# EAGLE design m-power-v0 (EAGLE 5.07)
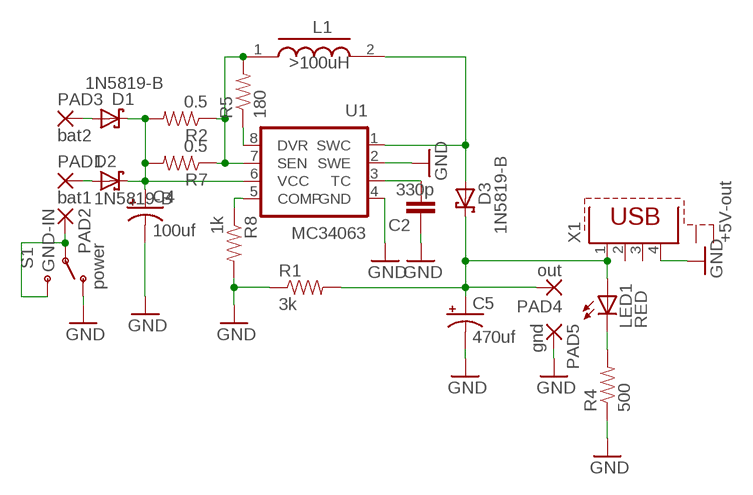
[diagram p0: schematic, sheet 1]

## Parts
C2  330p  CAPPTH  [CAP-PTH-SMALL]
C4  100uf  CAP_POLPTH1  [CPOL-RADIAL-100UF-25V]
C5  470uf  CAP_POLPTH1  [CPOL-RADIAL-100UF-25V]
D1  1N5819-B  [DO41-7.6]
D2  1N5819-B  [DO41-7.6]
D3  1N5819-B  [DO41-7.6]
L1  >100uH  INDUCTOR-IED22  [ED22]
LED1  RED  LED3MM  [LED3MM]
PAD1  bat1  3,17/1,1  [3,17/1,1]
PAD2  GND-IN  3,17/1,1  [3,17/1,1]
PAD3  bat2  3,17/1,1  [3,17/1,1]
PAD4  out  3,17/1,1  [3,17/1,1]
PAD5  gnd  3,17/1,1  [3,17/1,1]
R1  3k  RESISTOR1/4W  [AXIAL-0.3]
R2  0.5  RESISTOR1/4W  [AXIAL-0.3]
R4  500  RESISTOR0204/V(1/4W)  [0204V]
R5  180  RESISTOR1/4W  [AXIAL-0.3]
R7  0.5  RESISTOR1/4W  [AXIAL-0.3]
R8  1k  RESISTOR1/4W  [AXIAL-0.3]
S1  power  SWITCH-SPST3AM6  [SWITCH-SPDT-AM#6]
U1  MC34063  [DIP08-L]
X1  +5V-out  USB-PN87520-SS  [PN87520-S]

## Nets
GND: C2.1 C4.2(-) C5.2(-) PAD5.1(P) R1.P$1 R4.1 R8.P$2 S1.1(O) U1.2(SWE) U1.4(GND) X1.4
N$1: C2.2 U1.3(TC)
N$2: C4.1(+) D1.C D2.C R2.P$2 R7.P$2 U1.6(VCC)
N$3: R8.P$1 U1.5(COMP)
N$4: C5.1(+) D3.C LED1.A PAD4.1(P) R1.P$2 X1.1
N$5: LED1.K(C) R4.2
N$6: R5.P$1 U1.8(DVR)
N$7: D2.A PAD1.1(P)
N$8: L1.1 R2.P$1 R5.P$2 R7.P$1 U1.7(SEN)
N$9: D1.A PAD3.1(P)
N$10: D3.A L1.2 U1.1(SWC)
N$11: PAD2.1(P) S1.2(P) S1.3(S)
Unconnected: X1.2 X1.3 X1.S1 X1.S2

## Library data of the parts
C2 = SparkFun:CAP: Capacitor Standard 0603 ceramic capacitor, and 0.1" leaded capacitor.
C4 C5 = SparkFun:CAP_POL: Capacitor Polarized These are standard SMD and PTH capacitors. Normally 10uF, 47uF, and 100uF in electrolytic and tantalum varieties. Always verify the external diameter of the through hole cap, it varies with capacity, voltage, and manufacturer. The EIA devices should be standard.
D1-D3 = digital-toy:1N581*: 1.0A SCHOTTKY BARRIER RECTIFIER Source: http://www.diodes.com/datasheets/ds23001.pdf
L1 = digital-toy:INDUCTOR-I: Inductors with Iron
LED1 = SparkFun:LED: LEDs Standard schematic elements and footprints for 5mm, 3mm, 1206, and 0603 sized LEDs. 5mm - Spark Fun Electronics SKU : COM-00529 (and others)
PAD1-PAD5 = wirepad:3,17/1,1: THROUGH-HOLE PAD
R1 R2 R4 R5 R7 R8 = digital-toy:RESISTOR: Resistor Basic schematic elements and footprints for 0603, 1206, and PTH 1/10th watt (small) resistors. digital-toy copy vertical mount of axial-0.3 from rcl.lbr : the 0207/xx
S1 = digital-toy:SWITCH-SPST: SPST Switch Simple slide switch. Spark Fun Electronics SKU : COM-00102
U1 = digital-toy:MC34063: digital toy dip8-l smd
X1 = digital-toy:USB-PN87520-S

## Board
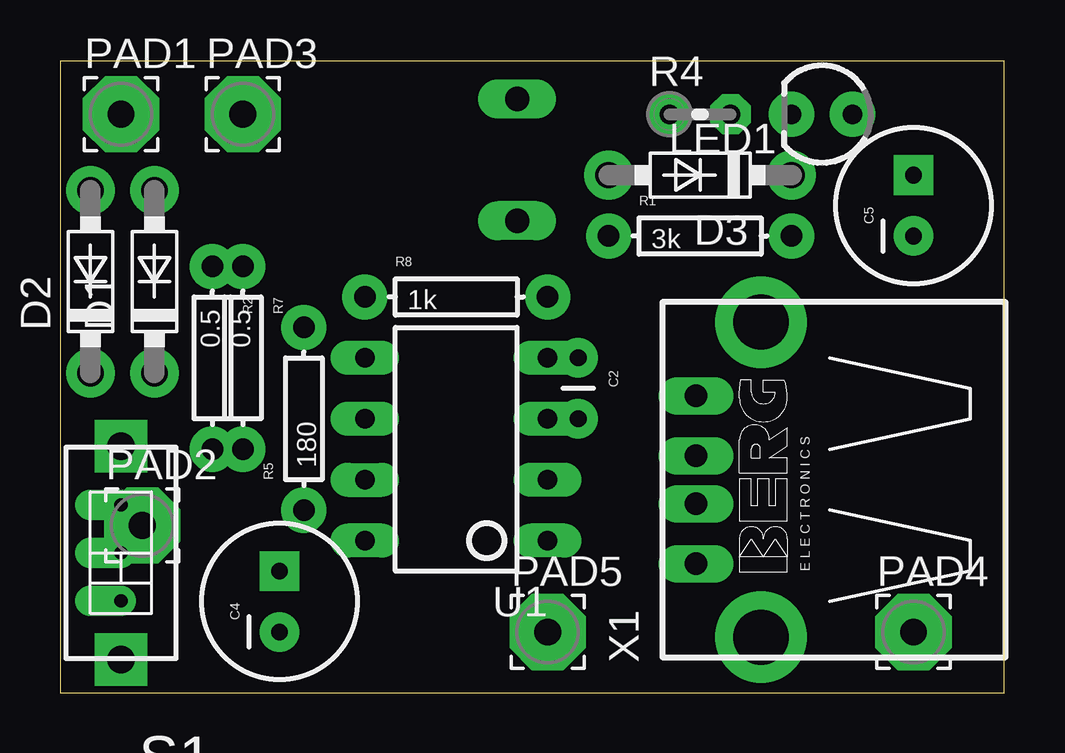
[diagram p1: board, top side]
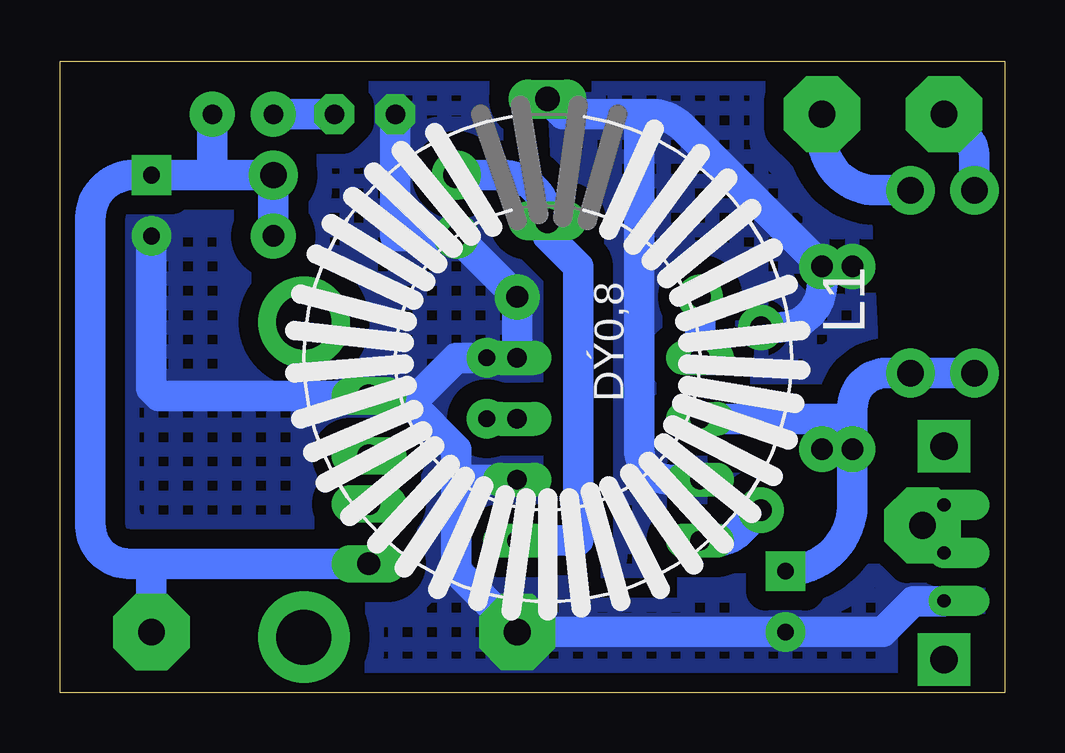
[diagram p2: board, bottom side, seen from below]

Size 39.35 x 26.34 mm. Coordinates in mm from the lower left corner, seen from the top.
Outline: 0,0 39.35,0 39.35,26.34 0,26.34 0,0
Copper layers (1*16): Top 0.035mm / dielectric 1.5mm / Bottom 0.035mm
Design rules "SparkFun-diy": minimum track width 8mil, minimum drill 20mil, track to track 10mil, track to pad 10mil, pad to pad 10mil, via to via 10mil, smd to smd 10mil, copper to edge 10mil, drill to drill 8mil, minimum pad ring 12mil, minimum via ring 10mil, stop-mask expansion 4mil, vias tented up to drill 25mil, thermal gap 10mil

### Footprints (pad centres in the part's own frame; a part is rotated, then mirrored left to right if it is on the bottom)
CAP-PTH-SMALL = drill 0.7 pad 1.651 round: 1 0,0; 2 2.54,0
CPOL-RADIAL-100UF-25V = drill 0.7 pad 1.651 square: 1 1.27,0 | drill 0.7 pad 1.651 round: 2 -1.27,0
DO41-7.6 = drill 1.1 pad 2.032 round: A 3.81,0; C -3.81,0
ED22 = drill 1.016 long: 1 -10.795,0; 2 -5.715,0
LED3MM = drill 0.813 pad 1.88 round: A -1.27,0; K 1.27,0
3,17/1,1 = drill 1.118 pad 3.175 octagon: 1 0,0
AXIAL-0.3 = drill 0.9 pad 1.88 round: P$1 -3.81,0; P$2 3.81,0
0204V = drill 0.813 pad 1.676 octagon: 1 -1.27,0; 2 1.27,0
SWITCH-SPDT-AM#6 = drill 0.55 pad 1.27 offset: 1 0,2; 2 0,0; 3 0,-2 | drill 1.15 pad 2.184 square: P$1 0,-4.445; P$2 0,4.445
DIP08-L = drill 0.813 long: 1 0,-2.54; 2 2.54,-2.54; 3 5.08,-2.54; 4 7.62,-2.54; 5 7.62,5.08; 6 5.08,5.08; 7 2.54,5.08; 8 0,5.08
PN87520-S = drill 0.95 long: 1 -3.5,2.71; 2 -1,2.71; 3 1,2.71; 4 3.5,2.71 | drill 2.3 pad 3.81 round: S1 -6.57,0; S2 6.57,0

### Placement (x,y rotation side)
C2  21.59,13.97 270 top
C4  9.14,3.81 90 top
C5  35.56,20.32 90 top
D1  3.94,17.14 90 top
D2  1.27,17.14 90 top
D3  26.67,21.59 180 top
L1  19.05,13.97 270 bottom
LED1  31.75,24.13 180 top
PAD1  2.54,24.13 0 top
PAD2  3.43,6.99 0 top
PAD3  7.62,24.13 0 top
PAD4  35.56,2.54 0 top
PAD5  20.32,2.54 0 top
R1  26.67,19.05 0 top
R2  6.35,13.97 270 top
R4  26.67,24.13 0 top
R5  10.16,11.43 90 top
R7  7.62,13.97 270 top
R8  16.51,16.51 0 top
S1  2.54,5.84 180 top
U1  17.78,6.35 90 top
X1  29.21,8.89 90 top

### Tracks (layer width: path | path; a pad name or v marks a point on that pad's centre or on a via)
GND
  Bottom 1.27: U1.4 R8.P$2 R1.P$1 25.4,19.05 R4.1 | U1.4 C2.1 | 22.86,8.89 22.86,5.08 PAD5.1 C4.2 5.08,2.54 3.81,3.81 2.57,3.81 S1.1 | 22.86,8.89 U1.2 | 24.77,12.06 22.86,10.16 22.86,8.89 | 24.77,12.06 25.09,12.39 X1.4 35.25,12.39 35.56,12.7 C5.2 | U1.4 22.86,13.97 24.77,12.06
  pour Bottom (isolate 0.813, rank 2, no thermals, hatched): -3.81,29.21 41.91,29.21 43.18,27.94 43.18,-1.27 -5.08,-1.27 -5.08,27.94
N$1
  Bottom 1.27: C2.2 U1.3
N$2
  Bottom 1.27: D2.C D1.C 4.93,13.34 arc-90 6.35,11.91 6.35,11.43 | R2.P$2 6.35,11.43 | R2.P$2 R7.P$2 | 6.35,11.43 U1.6 | C4.1 arc-90 6.35,7.87 R2.P$2
N$3
  Bottom 1.27: U1.5 R8.P$1
N$4
  Bottom 1.27: X1.1 35.56,5.39 | 33.02,21.59 C5.1 36.3,21.59 arc-90 38.1,19.79 38.1,6.98 arc-90 36.51,5.39 35.56,5.39 | 33.02,21.59 D3.C R1.P$2 | 35.56,5.39 PAD4.1 | 33.02,21.59 LED1.A
N$5
  Bottom 1.27: R4.2 LED1.K
N$6
  Bottom 1.27: R5.P$1 11.06,6.72 arc45 11.96,6.35 U1.8
N$7
  Bottom 1.27: D2.A 1.27,22.33 arc-45 1.64,23.23 PAD1.1
N$8
  Bottom 1.27: R7.P$1 R2.P$1 | L1.1 18.41,24.13 15.24,24.13 | 15.24,24.13 14.71,24.13 arc45 13.44,23.6 R7.P$1 | R7.P$1 7.62,17.04 arc90 9.42,15.24 R5.P$2 | U1.7 13.97,8.89 arc90 15.24,10.16 15.24,24.13
  pour Bottom (isolate 0.813, hatched): 6.35,30.48 5.08,5.08 17.78,5.08 19.05,30.48
N$9
  Bottom 1.27: D1.A 5.33,20.95 arc90 7.62,23.24 PAD3.1
N$10
  Bottom 1.27: D3.A 20.95,21.59 arc90 L1.2 19.05,19.05 17.78,17.78 17.78,6.35 U1.1
N$11
  Bottom 1.27: S1.2 S1.3 PAD2.1